# EAGLE design sample (EAGLE 9.5.0)

## Sheet 1 of 3
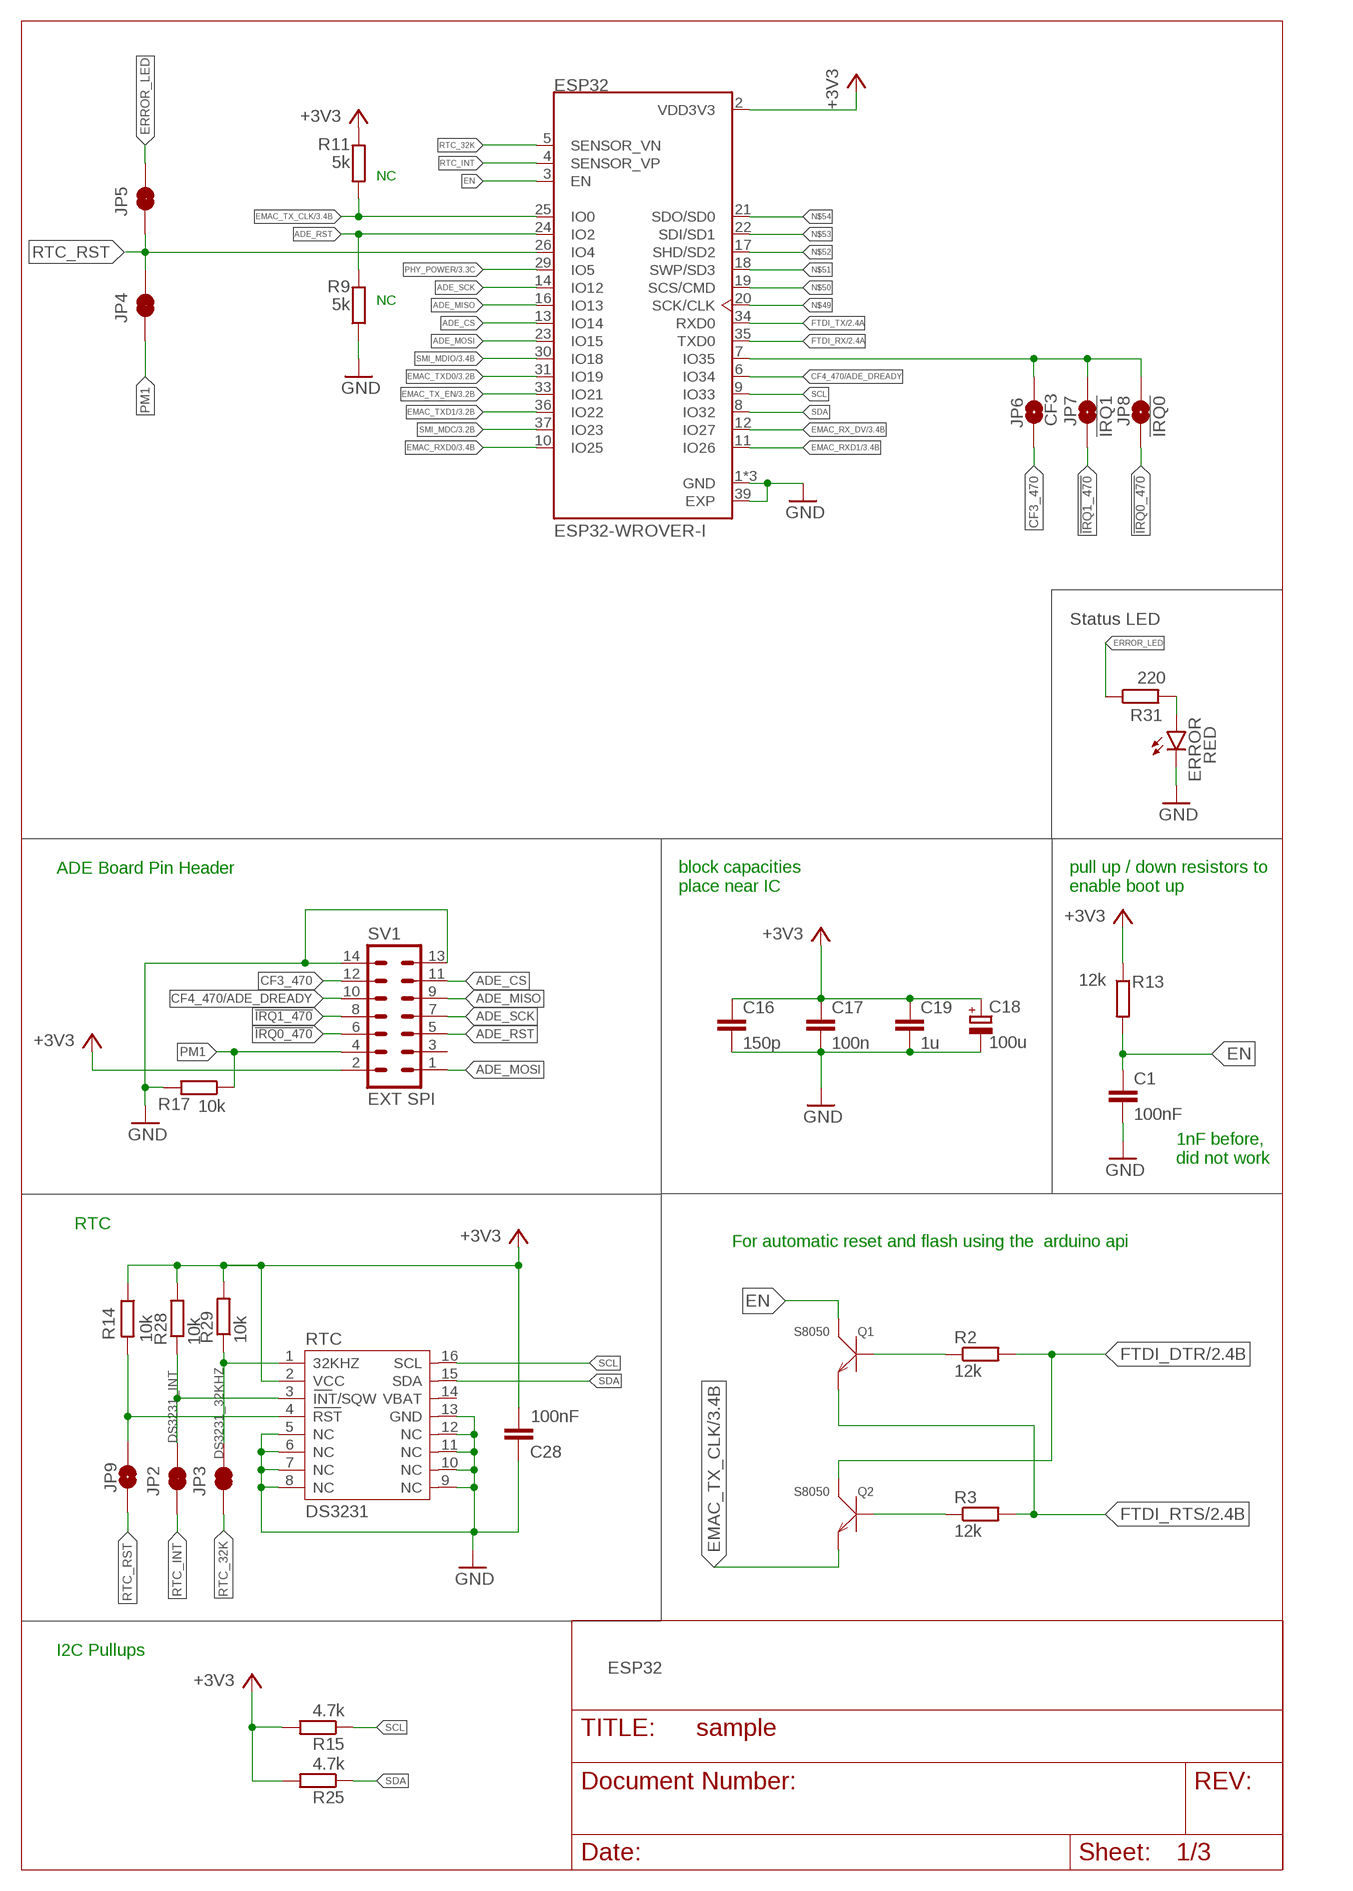
[diagram p0: schematic, sheet 1]

### Parts
C1  100nF  C-EUC0603K  [C0603K]
C16  150p  C-EUC0603K  [C0603K]
C17  100n  C-EUC0603K  [C0603K]
C18  100u  CPOL-EUD/7343-31W  [D/7343-31W]
C19  1u  C-EUC0603K  [C0603K]
C28  100nF  C-EUC0603K  [C0603K]
ERROR  RED  LEDCHIP-LED0805  [CHIP-LED0805]
ESP32  ESP32-WROVER-I  [XCVR_ESP32-WROVER-I]
JP2  INT  JUMPER-SMT_2_NC_TRACE_NO-SILK  [SMT-JUMPER_2_NC_TRACE_NO-SILK]
JP3  32K  JUMPER-SMT_2_NC_TRACE_NO-SILK  [SMT-JUMPER_2_NC_TRACE_NO-SILK]
JP4  PM1  JUMPER-SMT_2_NC_TRACE_NO-SILK  [SMT-JUMPER_2_NC_TRACE_NO-SILK]
JP5  ERROR  JUMPER-SMT_2_NC_TRACE_NO-SILK  [SMT-JUMPER_2_NC_TRACE_NO-SILK]
JP6  CF3  JUMPER-SMT_2_NO_NO-SILK  [SMT-JUMPER_2_NO_NO-SILK]
JP7  !IRQ1  JUMPER-SMT_2_NO_NO-SILK  [SMT-JUMPER_2_NO_NO-SILK]
JP8  !IRQ0  JUMPER-SMT_2_NO_NO-SILK  [SMT-JUMPER_2_NO_NO-SILK]
JP9  RST  JUMPER-SMT_2_NO_NO-SILK  [SMT-JUMPER_2_NO_NO-SILK]
Q1  S8050  SMD-TRANSISTORS-NPN-25V-500MW-S8050(SOT-23)  [SOT-23]
Q2  S8050  SMD-TRANSISTORS-NPN-25V-500MW-S8050(SOT-23)  [SOT-23]
R2  12k  R-EU_R0603  [R0603]
R3  12k  R-EU_R0603  [R0603]
R9  5k  R-EU_R0603  [R0603]
R11  5k  R-EU_R0603  [R0603]
R13  12k  R-EU_R0603  [R0603]
R14  10k  R-EU_R0603  [R0603]
R15  4.7k  R-EU_R0603  [R0603]
R17  10k  R-EU_R0402  [R0402]
R25  4.7k  R-EU_R0603  [R0603]
R28  10k  R-EU_R0603  [R0603]
R29  10k  R-EU_R0603  [R0603]
R31  220  R-EU_R0603  [R0603]
RTC  DS3231  [DS3231]
SV1  EXT SPI  ML14  [ML14]

### Nets
!IRQ0_470: JP8.2 SV1.6
!IRQ1_470: JP7.2 SV1.8
+3V3: C16.1 C17.1 C18.+ C19.1 C28.2 ESP32.2(VDD3V3) R11.1 R13.1 R14.1 R15.2 R25.2 R28.2 R29.2 RTC.2(VCC) SV1.2 ; also sheet 2,3
ADE_CS: ESP32.13(IO14) SV1.11
ADE_MISO: ESP32.16(IO13) SV1.9
ADE_MOSI: ESP32.23(IO15) SV1.1
ADE_RST: ESP32.24(IO2) R9.2 SV1.5
ADE_SCK: ESP32.14(IO12) SV1.7
CF3_470: JP6.1 SV1.12
CF4_470/ADE_DREADY: ESP32.6(IO34) SV1.10
DS3231_32KHZ: JP3.2 R29.1 RTC.1(32KHZ)
DS3231_INT: JP2.2 R28.1 RTC.3(INT/SQW)
DS3231_RST: JP9.2 R14.2 RTC.4(RST)
EMAC_RX_DV: ESP32.12(IO27) ; also sheet 3
EMAC_RXD0: ESP32.10(IO25) ; also sheet 3
EMAC_RXD1: ESP32.11(IO26) ; also sheet 3
EMAC_TX_CLK: ESP32.25(IO0) Q2.2(E) R11.2 ; also sheet 3
EMAC_TX_EN: ESP32.33(IO21) ; also sheet 3
EMAC_TXD0: ESP32.31(IO19) ; also sheet 3
EMAC_TXD1: ESP32.36(IO22) ; also sheet 3
EN: C1.1 ESP32.3(EN) Q1.3(C) R13.2
ERROR_LED: JP5.2 R31.1
FTDI_DTR: Q2.3(C) R2.2 ; also sheet 2
FTDI_RTS: Q1.2(E) R3.2 ; also sheet 2
FTDI_RX: ESP32.35(TXD0) ; also sheet 2
FTDI_TX: ESP32.34(RXD0) ; also sheet 2
GND: C1.2 C16.2 C17.2 C18.- C19.2 C28.1 ERROR.C ESP32.1(GND) ESP32.15(GND) ESP32.38(GND) ESP32.39(EXP) R9.1 R17.2 RTC.5(NC) RTC.6(NC) RTC.7(NC) RTC.8(NC) RTC.9(NC) RTC.10(NC) RTC.11(NC) RTC.12(NC) RTC.13(GND) SV1.13 SV1.14 ; also sheet 2,3
N$1: Q1.1(B) R2.1
N$2: Q2.1(B) R3.1
N$16: ERROR.A R31.2
N$29: ESP32.7(IO35) JP6.2 JP7.1 JP8.1
N$49: ESP32.20(SCK/CLK)
N$50: ESP32.19(SCS/CMD)
N$51: ESP32.18(SWP/SD3)
N$52: ESP32.17(SHD/SD2)
N$53: ESP32.22(SDI/SD1)
N$54: ESP32.21(SDO/SD0)
PHY_POWER: ESP32.29(IO5) ; also sheet 3
PM1: JP4.1 R17.1 SV1.4
RTC_32K: ESP32.5(SENSOR_VN) JP3.1
RTC_INT: ESP32.4(SENSOR_VP) JP2.1
RTC_RST: ESP32.26(IO4) JP4.2 JP5.1 JP9.1
SCL: ESP32.9(IO33) R15.1 RTC.16(SCL)
SDA: ESP32.8(IO32) R25.1 RTC.15(SDA)
SMI_MDC: ESP32.37(IO23) ; also sheet 3
SMI_MDIO: ESP32.30(IO18) ; also sheet 3
Unconnected: RTC.14(VBAT) SV1.3

### Notes on the sheet
- NC
- NC
- Status LED
- ADE Board Pin Header
- block capacities
  place near IC
- pull up / down resistors to
  enable boot up
- 1nF before,
  did not work
- RTC
- For automatic reset and flash using the  arduino api
- I2C Pullups
- ESP32

## Sheet 2 of 3
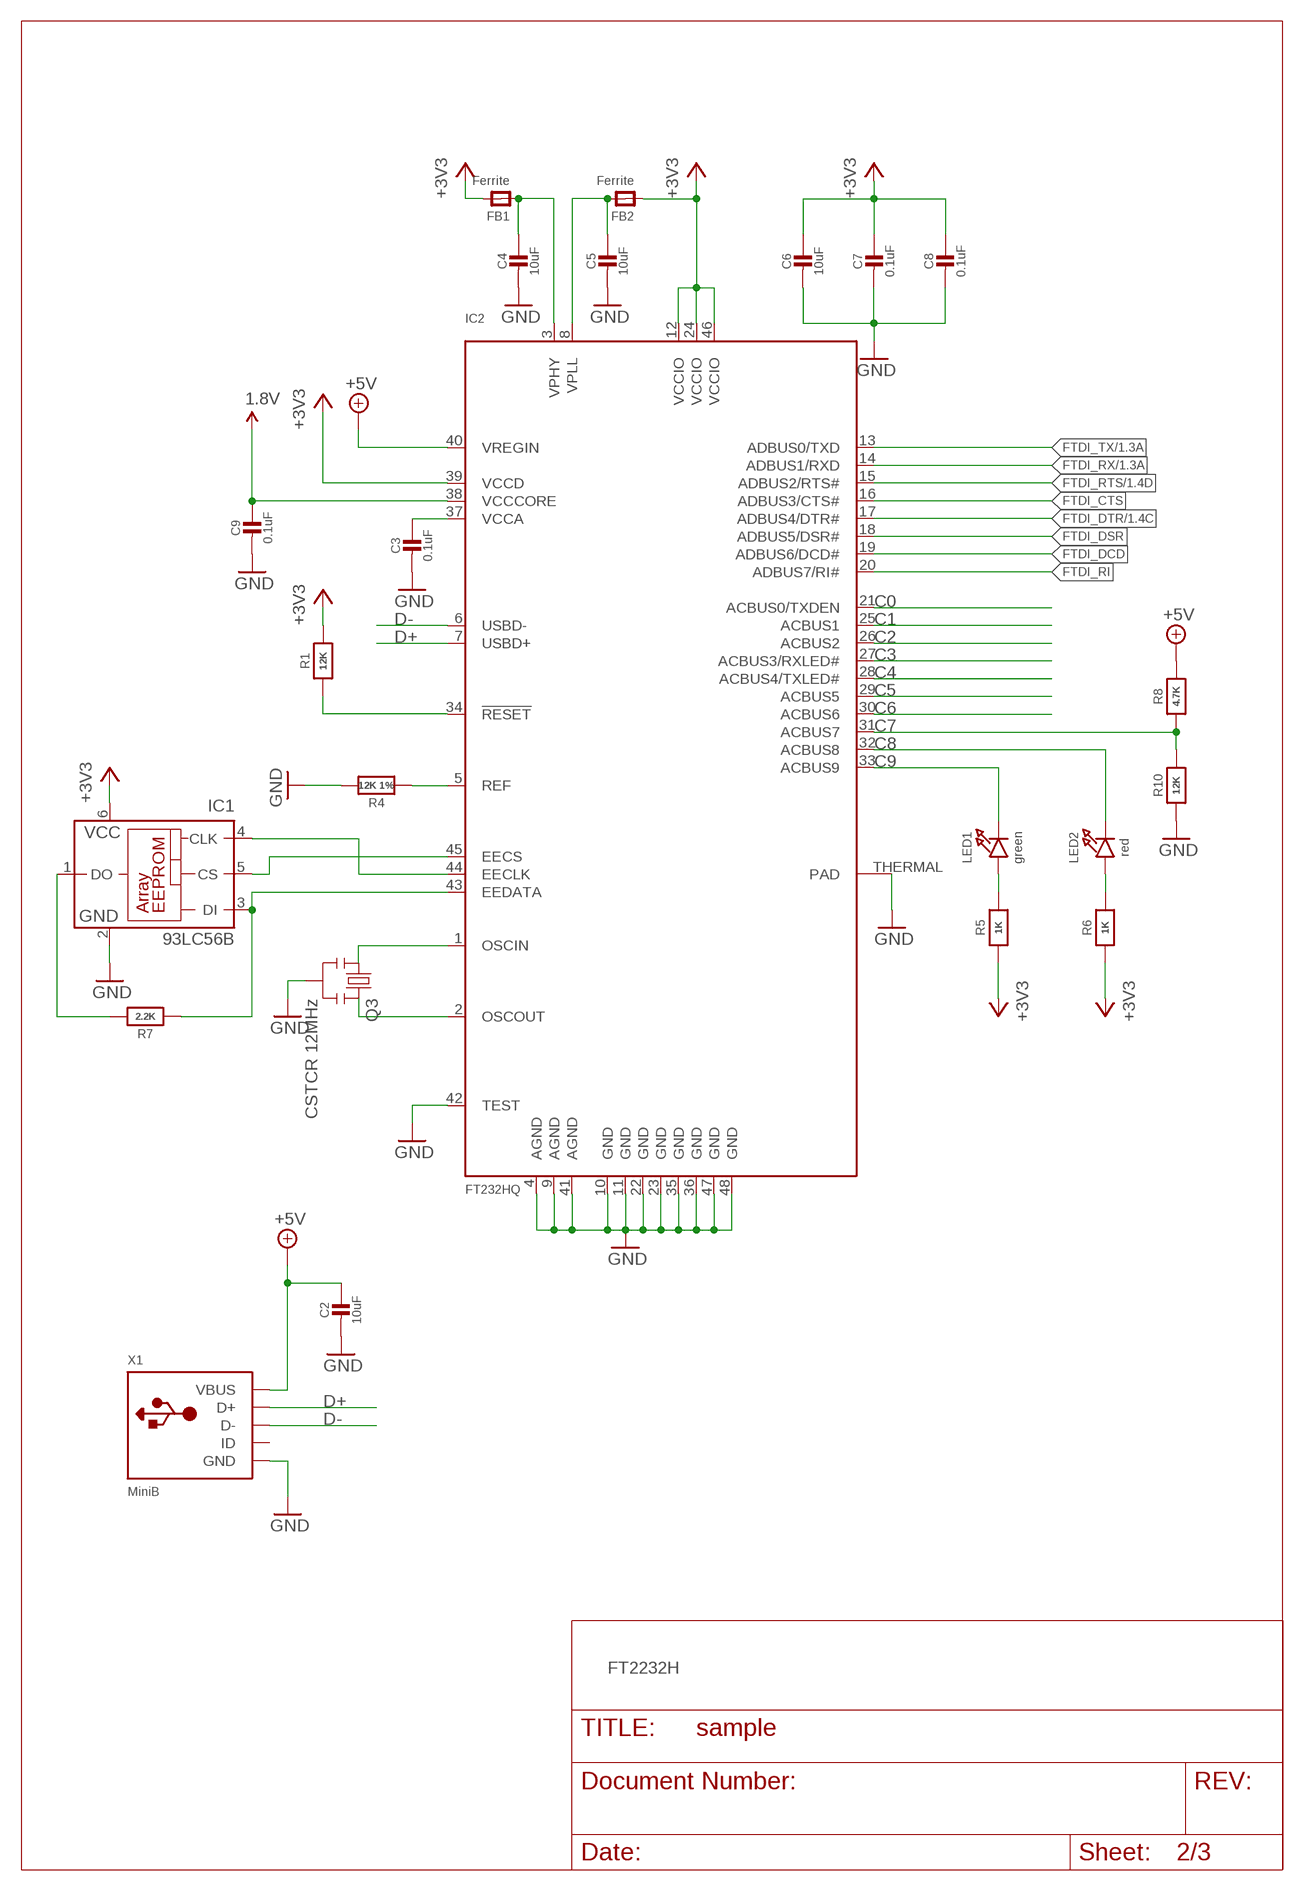
[diagram p1: schematic, sheet 2]

### Parts
C2  10uF  CAP_CERAMIC_0603MP  [_0603MP]
C3  0.1uF  CAP_CERAMIC_0603MP  [_0603MP]
C4  10uF  CAP_CERAMIC_0603MP  [_0603MP]
C5  10uF  CAP_CERAMIC_0603MP  [_0603MP]
C6  10uF  CAP_CERAMIC_0603MP  [_0603MP]
C7  0.1uF  CAP_CERAMIC_0603MP  [_0603MP]
C8  0.1uF  CAP_CERAMIC_0603MP  [_0603MP]
C9  0.1uF  CAP_CERAMIC_0603MP  [_0603MP]
FB1  Ferrite  FERRITE_0603MP  [_0603MP]
FB2  Ferrite  FERRITE_0603MP  [_0603MP]
IC1  93LC56B  93LC76A  [SOT23-6]
IC2  FT232HQ  [QFN48_8MM]
LED1  green  LED0603_NOOUTLINE  [CHIPLED_0603_NOOUTLINE]
LED2  red  LED0603_NOOUTLINE  [CHIPLED_0603_NOOUTLINE]
Q3  CSTCR 12MHz  RESONATORSMD  [RESONATOR-SMD]
R1  12K  RESISTOR_0603MP  [_0603MP]
R4  12K 1%  RESISTOR_0603MP  [_0603MP]
R5  1K  RESISTOR_0603MP  [_0603MP]
R6  1K  RESISTOR_0603MP  [_0603MP]
R7  2.2K  RESISTOR_0603MP  [_0603MP]
R8  4.7K  RESISTOR_0603MP  [_0603MP]
R10  12K  RESISTOR_0603MP  [_0603MP]
X1  MiniB  USBMICRO_20329  [4UCONN_20329]

### Nets
1.8V: C9.1 IC2.38(VCCCORE)
+3V3: C6.1 C7.1 C8.1 FB1.2 FB2.1 IC1.6(VCC) IC2.12(VCCIO) IC2.24(VCCIO) IC2.39(VCCD) IC2.46(VCCIO) R1.2 R5.1 R6.1 ; also sheet 1,3
+5V: C2.1 IC2.40(VREGIN) R8.2 X1.VBUS
C0: IC2.21(ACBUS0/TXDEN)
C1: IC2.25(ACBUS1)
C2: IC2.26(ACBUS2)
C3: IC2.27(ACBUS3/RXLED#)
C4: IC2.28(ACBUS4/TXLED#)
C5: IC2.29(ACBUS5)
C6: IC2.30(ACBUS6)
C7: IC2.31(ACBUS7) R8.1 R10.2
C8: IC2.32(ACBUS8) LED2.C
C9: IC2.33(ACBUS9) LED1.C
D+: IC2.7(USBD+) X1.D+
D-: IC2.6(USBD-) X1.D-
FTDI_CTS: IC2.16(ADBUS3/CTS#)
FTDI_DCD: IC2.19(ADBUS6/DCD#)
FTDI_DSR: IC2.18(ADBUS5/DSR#)
FTDI_DTR: IC2.17(ADBUS4/DTR#) ; also sheet 1
FTDI_RI: IC2.20(ADBUS7/RI#)
FTDI_RTS: IC2.15(ADBUS2/RTS#) ; also sheet 1
FTDI_RX: IC2.14(ADBUS1/RXD) ; also sheet 1
FTDI_TX: IC2.13(ADBUS0/TXD) ; also sheet 1
GND: C2.2 C3.2 C4.2 C5.2 C6.2 C7.2 C8.2 C9.2 IC1.2(GND) IC2.4(AGND) IC2.9(AGND) IC2.10(GND) IC2.11(GND) IC2.22(GND) IC2.23(GND) IC2.35(GND) IC2.36(GND) IC2.41(AGND) IC2.42(TEST) IC2.47(GND) IC2.48(GND) IC2.THERMAL(PAD) Q3.2 R4.2 R10.1 X1.BASE@1(GND) X1.BASE@2(GND) X1.GND X1.SPRT@1(GND) X1.SPRT@2(GND) X1.SPRT@3(GND) X1.SPRT@4(GND) ; also sheet 1,3
N$3: IC2.1(OSCIN) Q3.1
N$4: IC2.2(OSCOUT) Q3.3
N$5: IC2.5(REF) R4.1
N$6: LED2.A R6.2
N$7: IC2.34(!RESET) R1.1
N$8: LED1.A R5.2
N$9: IC1.3(DI) IC2.43(EEDATA) R7.1
N$10: IC1.5(CS) IC2.45(EECS)
N$11: IC1.4(CLK) IC2.44(EECLK)
N$12: IC1.1(DO) R7.2
VCCA: C3.1 IC2.37(VCCA)
VPHY: C4.1 FB1.1 IC2.3(VPHY)
VPLL: C5.1 FB2.2 IC2.8(VPLL)
Unconnected: X1.ID

### Notes on the sheet
- FT2232H

## Sheet 3 of 3
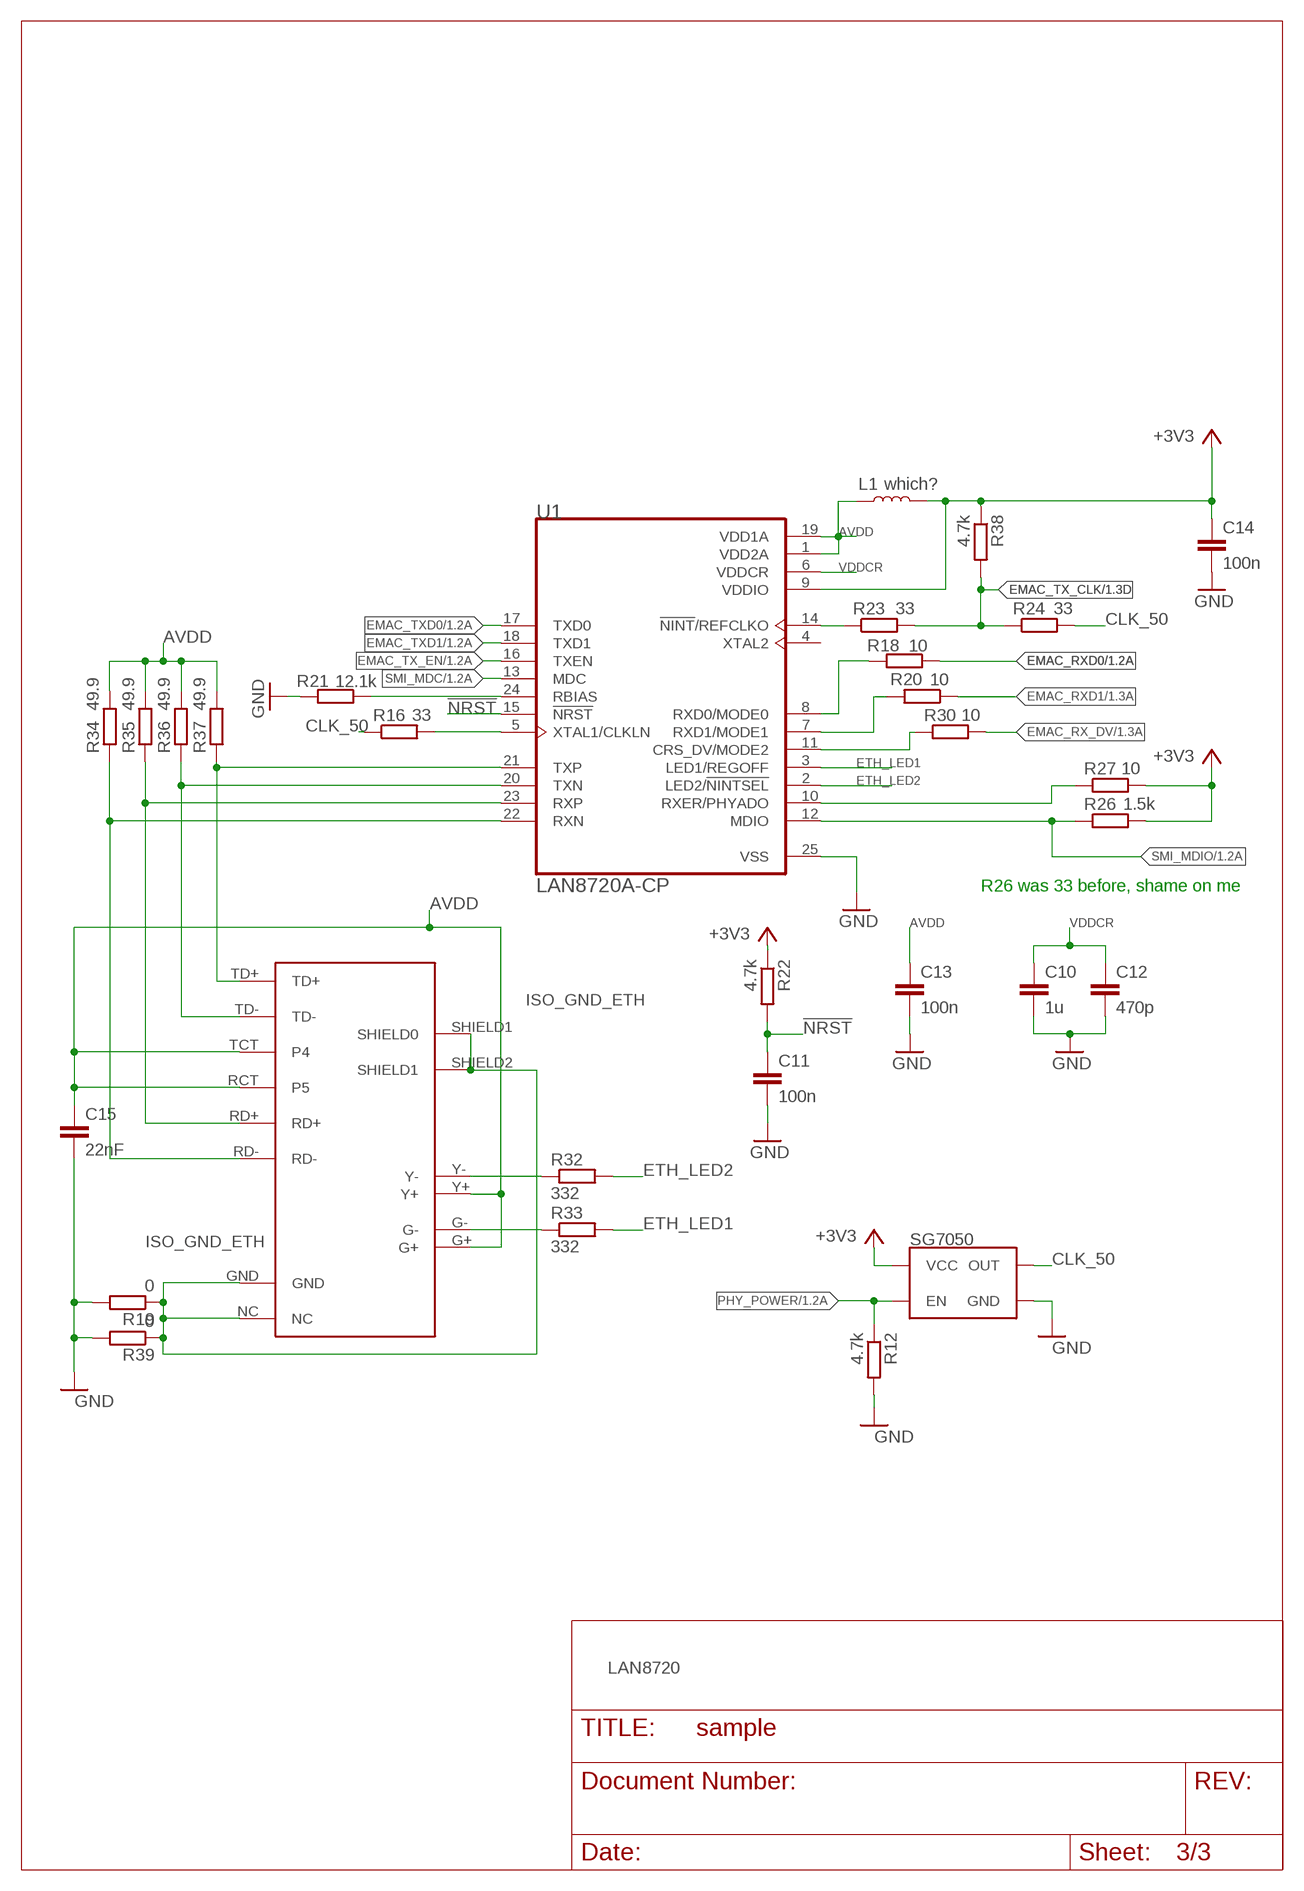
[diagram p2: schematic, sheet 3]

### Parts
C10  1u  C-EUC0402  [C0402]
C11  100n  C-EUC0603K  [C0603K]
C12  470p  C-EUC0402  [C0402]
C13  100n  C-EUC0603K  [C0603K]
C14  100n  C-EUC0603K  [C0603K]
C15  22nF  C-EUC0603K  [C0603K]
L1  which?  INDUCTOR-0603-33NH  [0603]
R12  4.7k  R-EU_R0603  [R0603]
R16  33  R-EU_R0603  [R0603]
R18  10  R-EU_R0603  [R0603]
R19  0  R-EU_R0603  [R0603]
R20  10  R-EU_R0603  [R0603]
R21  12.1k  R-EU_R0603  [R0603]
R22  4.7k  R-EU_R0603  [R0603]
R23  33  R-EU_R0603  [R0603]
R24  33  R-EU_R0603  [R0603]
R26  1.5k  R-EU_R0603  [R0603]
R27  10  R-EU_R0603  [R0603]
R30  10  R-EU_R0603  [R0603]
R32  332  R-EU_R0603  [R0603]
R33  332  R-EU_R0603  [R0603]
R34  49.9  R-EU_R0603  [R0603]
R35  49.9  R-EU_R0603  [R0603]
R36  49.9  R-EU_R0603  [R0603]
R37  49.9  R-EU_R0603  [R0603]
R38  4.7k  R-EU_R0603  [R0603]
R39  0  R-EU_R0603  [R0603]
SG7050  OSCILLATORSMD-7X5-4PAD  [OSCILLATOR-SMD-7X5-4PAD]
U1  LAN8720A-CP  [QFN50P400X400X100-25N]
U$2  HR911105A  [RJ45]

### Nets
!NRST: C11.1 R22.2 U1.15(!NRST)
+3V3: C14.1 L1.2 R22.1 R26.2 R27.2 R38.1 SG7050.4(VCC) U1.9(VDDIO) ; also sheet 1,2
AVDD: C13.1 C15.1 L1.1 R34.2 R35.2 R36.2 R37.2 U1.1(VDD2A) U1.19(VDD1A) U$2.G+ U$2.RCT(P5) U$2.TCT(P4) U$2.Y+
CLK_50: R16.1 R24.2 SG7050.3(OUT)
EMAC_RX_DV: R30.2 ; also sheet 1
EMAC_RXD0: R18.1 ; also sheet 1
EMAC_RXD1: R20.1 ; also sheet 1
EMAC_TX_CLK: R23.2 R24.1 R38.2 ; also sheet 1
EMAC_TX_EN: U1.16(TXEN) ; also sheet 1
EMAC_TXD0: U1.17(TXD0) ; also sheet 1
EMAC_TXD1: U1.18(TXD1) ; also sheet 1
ETH_LED1: R33.2 U1.3(LED1/REGOFF)
ETH_LED2: R32.2 U1.2(LED2/!NINTSEL!)
GND: C10.2 C11.2 C12.2 C13.2 C14.2 C15.2 R12.2 R19.2 R21.2 R39.2 SG7050.2(GND) U1.25(VSS) ; also sheet 1,2
ISO_GND_ETH: R19.1 R39.1 U$2.GND U$2.NC U$2.SHIELD1(SHIELD0) U$2.SHIELD2(SHIELD1)
N$14: R20.2 U1.7(RXD1/MODE1)
N$15: R18.2 U1.8(RXD0/MODE0)
N$17: R21.1 U1.24(RBIAS)
N$18: R32.1 U$2.Y-
N$19: R16.2 U1.5(XTAL1/CLKLN)
N$20: R27.1 U1.10(RXER/PHYADO)
N$21: R23.1 U1.14(!NINT!/REFCLKO)
N$22: R30.1 U1.11(CRS_DV/MODE2)
N$23: R33.1 U$2.G-
PHY_POWER: R12.1 SG7050.1(EN) ; also sheet 1
RD_N [DiffPairs]: R34.1 U1.22(RXN) U$2.RD-
RD_P [DiffPairs]: R35.1 U1.23(RXP) U$2.RD+
SMI_MDC: U1.13(MDC) ; also sheet 1
SMI_MDIO: R26.1 U1.12(MDIO) ; also sheet 1
TD_N [DiffPairs]: R36.1 U1.20(TXN) U$2.TD-
TD_P [DiffPairs]: R37.1 U1.21(TXP) U$2.TD+
VDDCR: C10.1 C12.1 U1.6(VDDCR)
Unconnected: U1.4(XTAL2)

### Notes on the sheet
- R26 was 33 before, shame on me
- LAN8720

## Library data of the parts
C1 C10-C17 C19 C28 = rcl:C-EU: CAPACITOR, European symbol; SPICEPREFIX: C
C2-C9 = microbuilder:CAP_CERAMIC: Ceramic Capacitors For new designs, use the packages preceded by an '_' character since they are more reliable: The following footprints should be used on most boards: _0402 - Standard footprint for regular board layouts _0603 - Standard footprint for regular board layouts _0805 - Standard footprint for regular board layouts _1206 - Standard footprint for regular board layouts For extremely tight-pitch boards where space is at a premium, the following 'micro-pitch' footprints can be used (smaller pads, no silkscreen outline, etc.): _0402MP - Micro-pitch footprint for very dense/compact boards _0603MP - Micro-pitch footprint for very dense/compact boards _0805MP - Micro-pitch footprint for very dense/compact boards _1206MP - Micro-pitch footprint for very dense/compact boards
C18 = rcl:CPOL-EU: POLARIZED CAPACITOR, European symbol; SPICEPREFIX: C
ERROR = led:LED: LED
ESP32 = ESP32-WROVER-I:ESP32-WROVER-I: Module: combo; GPIO, I2C x2, I2S x2, SDIO, SPI x3, UART x3; U.FL; AVAILABILITY: Unavailable; DESCRIPTION: Module: combo; GPIO, I2C x2, I2S x2, SDIO, SPI x3, UART x3; U.FL; MF: Espressif Systems; MP: ESP32-WROVER-I; PACKAGE: Module Espressif Systems; PRICE: None
FB1 FB2 = microbuilder:FERRITE: Ferrite Bead 0603 MMZ1608B121C - 120 Ohm @ 100MHz, 600mA, 0.15 Ohm DC Resistance - Digikey: 445-2164-1-ND BK1608HW121-T - 120 Ohm, 600mA Ferrite Chip - Digikey: 587-1876-2-ND 0805 HZ0805B272R-10 - 2.7K Ohm @ 100MHz, 200mA, 0.8 Ohm DC Resistance - Digikey: 240-2504-1-ND (see also Murata BLM21BD272SN1L) MMZ2012Y152B - 1.5K Ohm @ 100MHz, 500mA, 0.4 Ohm DC Resistance - Digikey: 445-1560-1-ND - Mainly for high frequency (80-400MHz) MMZ2012R102A - 1K Ohm @ 100MHz, 500mA, 0.3 Ohm DC Resistance - Digikey: 445-1555-2-ND - More general purpose (10-200MHz)
IC1 = microchip:93*76?: 8K Microwire Compatible Serial EEPROM Source: http://ww1.microchip.com/downloads/en/DeviceDoc/21796H.pdf; MF: MICROCHIP; MPN: 93LC76AT-I/OT; OC_FARNELL: 1556170; OC_NEWARK: 61H6824
IC2 = microbuilder:FT232H
JP2-JP5 = SparkFun-Jumpers:JUMPER-SMT_2_NC_TRACE: Normally closed trace jumper This jumper has a trace between two pads so it's normally closed (NC). Use a razor knife to open the connection. For best results follow the IPC guidelines for cutting traces: Cutout at least 0.063 mm (0.005 in). Remove all loose material to clean up the cut area. Seal the cut with an approved epoxy. Reapply solder to reclose the connection.
JP6-JP9 = SparkFun-Jumpers:JUMPER-SMT_2_NO: Normally open jumper This jumper has two pads in close proximity to each other. Apply solder to close the connection. Round pads are easier to solder for beginners, but are a lot larger. SparkFun Product that uses the round pads: SparkFun EL Sequencer <https://www.sparkfun.com/products/12781>
L1 = SparkFun-Coils:INDUCTOR: Inductors Resist changes in electrical current. Basically a coil of wire. SparkFun Products: SparkFun Load Cell Amplifier - HX711 <https://www.sparkfun.com/products/13879> IOIO-OTG - V2.2 <https://www.sparkfun.com/products/13613>; PROD_ID: NDUC-07874; VALUE: 33nH/±5%/500mA
LED1 LED2 = microbuilder:LED: LED
Q1 Q2 = Seeed-Transistor:SMD-TRANSISTORS-NPN-25V-500MW-S8050(SOT-23): 305010017; MPN: S8050
Q3 = SparkFun:RESONATOR: Resonator Small SMD resonator. This is the itty bitty 10/20MHz resonators with built in caps. CSTCE10M0G55 and CSTCE20M0V53. Footprint has been reviewed closely but hasn't been tested yet.
R1 R4-R8 R10 = microbuilder:RESISTOR: Resistors For new designs, use the packages preceded by an '_' character since they are more reliable: The following footprints should be used on most boards: _0402 - Standard footprint for regular board layouts _0603 - Standard footprint for regular board layouts _0805 - Standard footprint for regular board layouts _1206 - Standard footprint for regular board layouts For extremely tight-pitch boards where space is at a premium, the following 'micro-pitch' footprints can be used (smaller pads, no silkscreen outline, etc.): _0402MP - Micro-pitch footprint for very dense/compact boards _0603MP - Micro-pitch footprint for very dense/compact boards _0805MP - Micro-pitch footprint for very dense/compact boards _1206MP - Micro-pitch footprint for very dense/compact boards
R2 R3 R9 R11-R39 = resistor:R-EU_: RESISTOR, European symbol
RTC = _lh-library:DS3231
SG7050 = SparkFun-Clocks:OSCILLATOR: Oscillators (Generic) These are active oscillators, which require a power source to generate their clock output. Most oscillators are configured to generate a set frequency (e.g. 16MHz). They have four pins: power, ground, output, and an enable input.
SV1 = con-harting-ml:ML14: HARTING; OC_FARNELL: unknown; OC_NEWARK: unknown
U1 = LAN8720A-CP:LAN8720A-CP: LAN8720A Series 3.3 V RMII 10/100 Ethernet Transceiver Surface Mount - QFN-24; AVAILABILITY: Unavailable; DESCRIPTION: LAN8720A Series 3.3 V RMII 10/100 Ethernet Transceiver Surface Mount - QFN-24; MF: Microchip; MP: LAN8720A-CP; PACKAGE: QFN-24 Microchip; PRICE: None
U$2 = HR911105A:HR911105A
X1 = microbuilder:USB: USB Connectors USBMINIB - Surface Mount Female Mini-B USB Connector 4UConnector: 06564

## Net classes
1 DiffPairs: width 0.051 mm

## Board
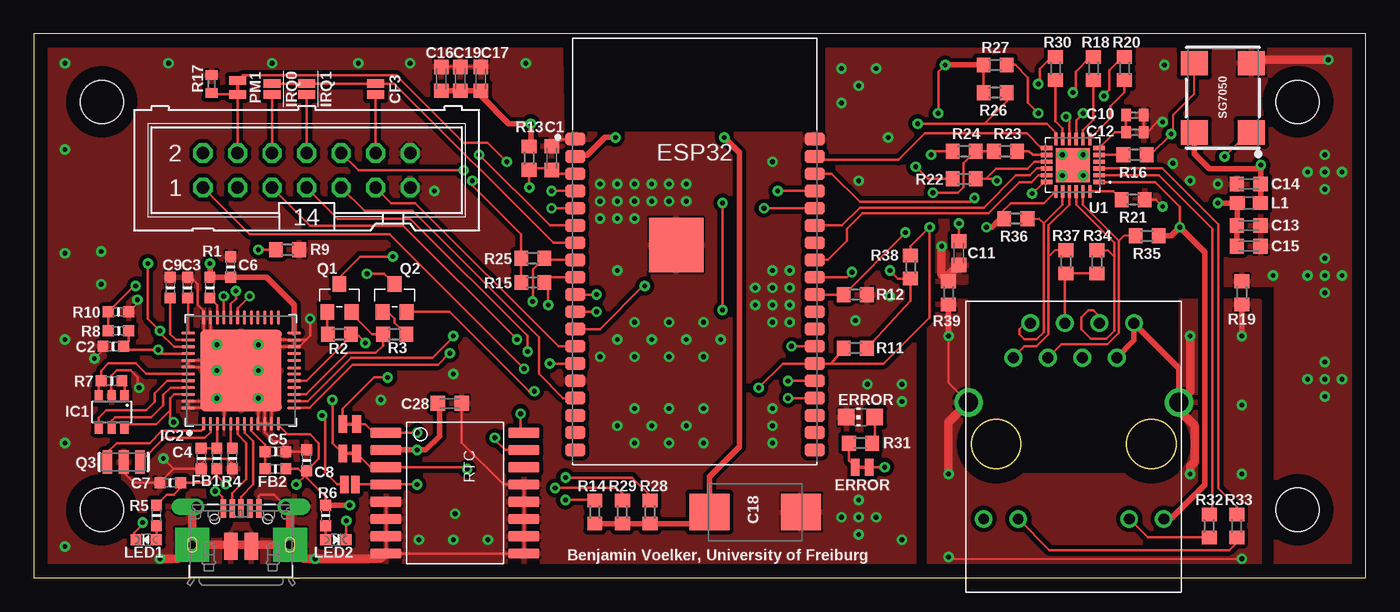
[diagram p3: board, top side]
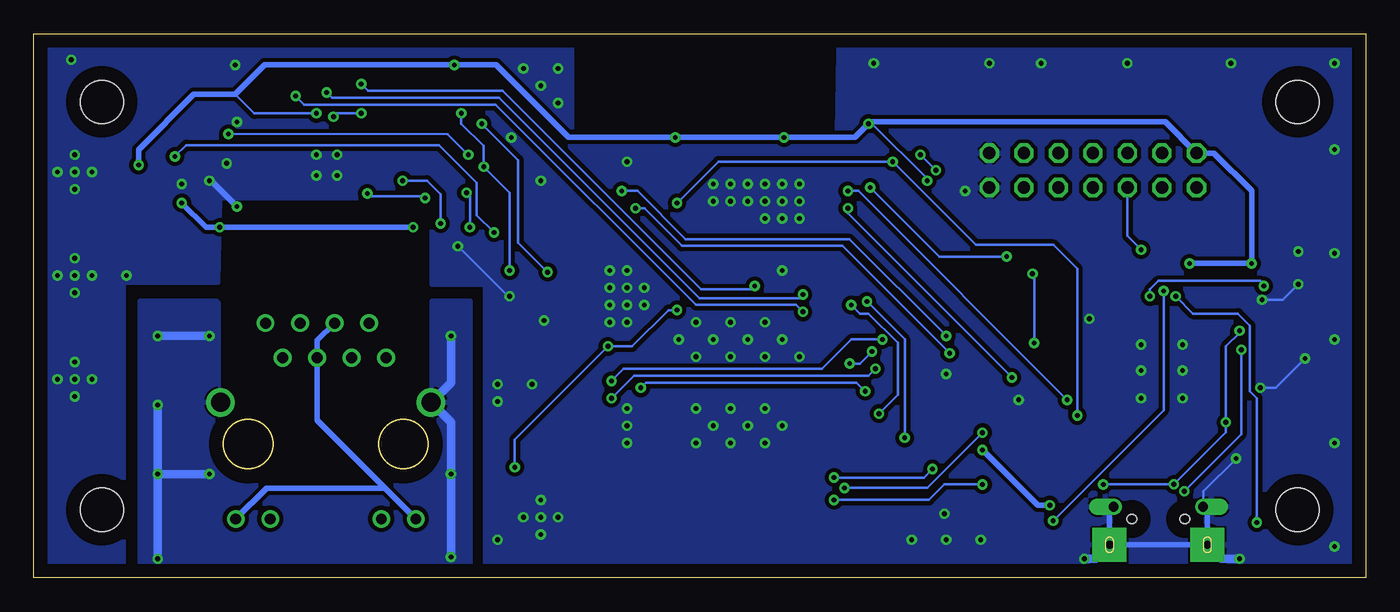
[diagram p4: board, bottom side, seen from below]

Size 98 x 40 mm. Coordinates in mm from the lower left corner, seen from the top.
Outline: 0,0 98,0 98,40 0,40 0,0
Copper layers (1*16): Top 0.035mm / dielectric 1.5mm / Bottom 0.035mm
Design rules "default *": minimum track width 6mil, minimum drill 0.35mm, track to track 6mil, track to pad 6mil, pad to pad 6mil, via to via 6mil, smd to smd 6mil, copper to edge 40mil, drill to drill 4mil, minimum pad ring 10mil, minimum via ring 8mil, stop-mask expansion 4mil, vias tented up to drill 0mil, thermal gap 6mil
Holes 3.2 mm at 5,35 5,5 93,5 93,35

### Footprints (pad centres in the part's own frame; a part is rotated, then mirrored left to right if it is on the bottom)
C0603K = smd 1.05 x 1.08: 1 -0.875,0; 2 0.875,0
_0603MP = smd 0.8 x 0.8: 1 -0.762,0; 2 0.762,0
C0402 = smd 0.7 x 0.9: 1 -0.65,0; 2 0.65,0
D/7343-31W = smd 2.95 x 2.7: + 3.375,0; - -3.375,0
CHIP-LED0805 = smd 1.2 x 1.2: A 0,-1.05; C 0,1.05
XCVR_ESP32-WROVER-I = smd 1.45 x 0.93: 1 -8.81,8.26; 2 -8.81,6.99; 3 -8.81,5.72; 4 -8.81,4.45; 5 -8.81,3.18; 6 -8.81,1.91; 7 -8.81,0.64; 8 -8.81,-0.63; 9 -8.81,-1.9; 10 -8.81,-3.17; 11 -8.81,-4.44; 12 -8.81,-5.71; 13 -8.81,-6.98; 14 -8.81,-8.25; 15 -8.81,-9.52; 16 -8.81,-10.79; 17 -8.81,-12.06; 18 -8.81,-13.33; 19 -8.81,-14.6; 20 8.81,-14.6; 21 8.81,-13.33; 22 8.81,-12.06; 23 8.81,-10.79; 24 8.81,-9.52; 25 8.81,-8.25; 26 8.81,-6.98; 27 8.81,-5.71; 28 8.81,-4.44; 29 8.81,-3.17; 30 8.81,-1.9; 31 8.81,-0.63; 32 8.81,0.64; 33 8.81,1.91; 34 8.81,3.18; 35 8.81,4.45; 36 8.81,5.72; 37 8.81,6.99; 38 8.81,8.26 | smd 4 x 4: 39 -1.38,0.47
SOT23-6 = smd 0.6 x 0.9: 1 -0.95,-1.15; 2 0,-1.15; 3 0.95,-1.15; 4 0.95,1.15; 5 0,1.15; 6 -0.95,1.15
QFN48_8MM = smd 1 x 0.23: 1 -3.9,2.75; 2 -3.9,2.25; 3 -3.9,1.75; 4 -3.9,1.25; 5 -3.9,0.75; 6 -3.9,0.25; 7 -3.9,-0.25; 8 -3.9,-0.75; 9 -3.9,-1.25; 10 -3.9,-1.75; 11 -3.9,-2.25; 12 -3.9,-2.75; 25 3.9,-2.75; 26 3.9,-2.25; 27 3.9,-1.75; 28 3.9,-1.25; 29 3.9,-0.75; 30 3.9,-0.25; 31 3.9,0.25; 32 3.9,0.75; 33 3.9,1.25; 34 3.9,1.75; 35 3.9,2.25; 36 3.9,2.75 | smd 0.23 x 1: 13 -2.75,-3.9; 14 -2.25,-3.9; 15 -1.75,-3.9; 16 -1.25,-3.9; 17 -0.75,-3.9; 18 -0.25,-3.9; 19 0.2,-3.9; 20 0.75,-3.9; 21 1.25,-3.9; 22 1.75,-3.9; 23 2.25,-3.9; 24 2.75,-3.9; 37 2.75,3.9; 38 2.25,3.9; 39 1.75,3.9; 40 1.25,3.9; 41 0.75,3.9; 42 0.25,3.9; 43 -0.25,3.9; 44 -0.75,3.9; 45 -1.25,3.9; 46 -1.75,3.9; 47 -2.25,3.9; 48 -2.75,3.9 | smd 6 x 6: THERMAL 0,0
SMT-JUMPER_2_NC_TRACE_NO-SILK = smd 0.635 x 1.27: 1 -0.508,0; 2 0.508,0
SMT-JUMPER_2_NO_NO-SILK = smd 0.635 x 1.27: 1 -0.406,0; 2 0.406,0
0603 = smd 1.1 x 1: 1 -0.85,0; 2 0.85,0
CHIPLED_0603_NOOUTLINE = smd 0.8 x 0.8: A 0,-0.75; C 0,0.75
SOT-23 = smd 1.016 x 1.143: 1 -0.889,-1.016; 2 0.889,-1.016; 3 0,1.016
RESONATOR-SMD = smd 0.7 x 1.7: 1 -1.2,0; 2 0,0; 3 1.2,0
R0603 = smd 1 x 1.1: 1 -0.85,0; 2 0.85,0
R0402 = smd 0.7 x 0.9: 1 -0.65,0; 2 0.65,0
DS3231 = smd 0.762 x 2.286: 1 -4.445,-5.08; 2 -3.175,-5.08; 3 -1.905,-5.08; 4 -0.635,-5.08; 5 0.635,-5.08; 6 1.905,-5.08; 7 3.175,-5.08; 8 4.445,-5.08; 9 4.445,5.08; 10 3.175,5.08; 11 1.905,5.08; 12 0.635,5.08; 13 -0.635,5.08; 14 -1.905,5.08; 15 -3.175,5.08; 16 -4.445,5.08
OSCILLATOR-SMD-7X5-4PAD = smd 1.8 x 2: 1 -2.54,-2.095; 2 2.54,-2.095; 3 2.54,2.104; 4 -2.54,2.104
ML14 = drill 0.914 octagon: 1 -7.62,-1.27; 2 -7.62,1.27; 3 -5.08,-1.27; 4 -5.08,1.27; 5 -2.54,-1.27; 6 -2.54,1.27; 7 0,-1.27; 8 0,1.27; 9 2.54,-1.27; 10 2.54,1.27; 11 5.08,-1.27; 12 5.08,1.27; 13 7.62,-1.27; 14 7.62,1.27
QFN50P400X400X100-25N = smd 0.86 x 0.26: 1 -1.935,1.25; 2 -1.935,0.75; 3 -1.935,0.25; 4 -1.935,-0.25; 5 -1.935,-0.75; 6 -1.935,-1.25; 13 1.935,-1.25; 14 1.935,-0.75; 15 1.935,-0.25; 16 1.935,0.25; 17 1.935,0.75; 18 1.935,1.25 | smd 0.26 x 0.86: 7 -1.25,-1.935; 8 -0.75,-1.935; 9 -0.25,-1.935; 10 0.25,-1.935; 11 0.75,-1.935; 12 1.25,-1.935; 19 1.25,1.935; 20 0.75,1.935; 21 0.25,1.935; 22 -0.25,1.935; 23 -0.75,1.935; 24 -1.25,1.935 | smd 2.5 x 2.5: 25 0,0
RJ45 = drill 0.8: G+ 5.84,-6.305; G- 5.84,-3.765; GND -8.57,4.76; NC -6.03,3.5; RCT -6.03,0.96; RD+ -6.03,-1.58; RD- -8.57,2.22; TCT -8.57,-0.32; TD+ -6.03,-4.12; TD- -8.57,-2.86; Y+ 5.84,6.945; Y- 5.84,4.405 | drill 1.4: SHIELD1 -2.73,-7.425; SHIELD2 -2.73,8.065
4UCONN_20329 = smd 1 x 2: BASE@1 -0.75,-2; BASE@2 0.75,-2 | smd 0.4 x 1.35: D+ 0,0.775; D- -0.65,0.775; GND 1.3,0.775; ID 0.65,0.775; VBUS -1.3,0.775 | drill 0.7 offset: SPRT@1 -3.3,0.9; SPRT@2 3.3,0.9 | drill 0.6 pad 2.5 square: SPRT@3 -3.6,-1.9; SPRT@4 3.6,-1.9 | hole 0.7: -1.95,0; 1.95,0

### Placement (x,y rotation side)
C1  38.1,30.86 90 top
C2  5.84,17.02 180 top
C3  11.3,21.34 90 top
C4  12.32,8.76 270 top
C5  17.78,9.27 0 top
C6  14.48,22.86 90 top
C7  10.03,6.99 180 top
C8  20.07,8.64 90 top
C9  10.03,21.34 90 top
C10  81.03,34.04 0 top
C11  68.07,23.88 270 top
C12  81.03,32.77 0 top
C13  89.41,25.91 0 top
C14  89.41,28.96 180 top
C15  89.41,24.38 0 top
C16  29.97,36.7 90 top
C17  32.89,36.7 90 top
C18  53.09,4.83 180 top
C19  31.37,36.7 90 top
C28  30.61,12.83 180 top
ERROR  60.83,11.81 90 top
ESP32  48.64,24 0 top
FB1  13.46,8.76 270 top
FB2  17.78,8 180 top
IC1  5.71,12.19 180 top
IC2  15.24,15.24 90 top
JP2  23.24,9.14 0 top
JP3  23.24,11.3 0 top
JP4  14.99,36.07 90 top
JP5  60.96,8.13 180 top
JP6  25.15,35.94 90 top
JP7  20.07,35.94 270 top
JP8  17.53,35.94 270 top
JP9  23.24,6.86 0 top
L1  89.41,27.56 0 top
LED1  8.26,2.79 90 top
LED2  22.23,2.79 270 top
Q1  22.48,20.57 0 top
Q2  26.54,20.57 0 top
Q3  6.6,8.51 0 top
R1  12.95,21.34 90 top
R2  22.48,17.91 0 top
R3  26.54,17.91 180 top
R4  14.61,8.76 270 top
R5  9.02,4.57 270 top
R6  21.46,4.57 270 top
R7  5.71,14.48 0 top
R8  6.22,18.16 0 top
R9  18.67,24.13 180 top
R10  6.22,19.56 180 top
R11  60.45,16.89 180 top
R12  60.45,20.83 0 top
R13  36.45,30.86 270 top
R14  41.27,4.83 90 top
R15  36.7,21.72 180 top
R16  81.03,31.11 180 top
R17  13.08,36.32 90 top
R18  77.98,37.47 270 top
R19  88.9,20.95 90 top
R20  80.26,37.47 270 top
R21  80.9,27.81 0 top
R22  68.45,29.34 0 top
R23  71.5,31.37 180 top
R24  68.45,31.37 180 top
R25  36.7,23.5 180 top
R26  70.74,35.69 180 top
R27  70.74,37.72 180 top
R28  45.34,4.83 270 top
R29  43.31,4.83 270 top
R30  75.18,37.47 90 top
R31  60.83,9.91 0 top
R32  86.49,3.81 90 top
R33  88.52,3.81 90 top
R34  78.23,23.24 270 top
R35  81.92,25.15 0 top
R36  72.26,26.42 180 top
R37  75.95,23.24 270 top
R38  64.52,22.86 90 top
R39  67.31,20.95 90 top
RTC  30.99,6.22 270 top
SG7050  87.5,35.31 90 top
SV1  20.07,29.97 0 top
U1  76.45,30.35 180 top
U$2  76.2,10.16 270 top
X1  15.24,4.32 0 top

### Tracks (layer width: path | path; a pad name or v marks a point on that pad's centre or on a via)
1.8V
  Top 0.2: IC2.38 10.45,17.49 10.03,17.91 C9.1
!IRQ0_470
  Top 0.2: JP8.2 SV1.6
!IRQ1_470
  Top 0.2: JP7.2 SV1.8
!NRST  (via drill 0.35)
  Top 0.2: U1.15 73.63,30.6 73.12,30.09 70.81,30.09 70.05,29.34 R22.2 70.74,29.34 v70.87,29.21 | C11.1 v68.07,26.05
  Bottom 0.2: v70.87,29.21 v70.86,29.21 69.08,29.21 68.07,28.2 v68.07,26.05
+3V3  (via drill 0.35)
  Top 0.2: IC2.46 10.31,13.49 10.03,13.21 10.03,12.32 | 10.03,12.32 9.01,11.3 6.92,11.3 IC1.6 | R6.1 21.46,5.97 20.07,7.37 | FB2.1 19.43,8 20.07,7.37 | 20.07,7.62 C8.1 20.95,8.76 20.95,9.91 20.32,10.54 18.67,10.54 17.99,11.22 IC2.12 | 20.07,7.62 20.07,7.37 | R5.1 9.78,6.1 10.29,6.1 10.79,6.6 C7.1 12.83,6.99 13.4,7.56 | v14.11,6.87 v14.09,6.87 13.4,7.56 | v19.3,6.86 20.07,7.62 | 13.4,7.56 13.46,7.62 FB1.2 | 10.03,12.32 10.03,11.68 v10.28,11.43 | IC2.39 10.31,16.99 9.27,18.03 v9.27,18.16 8.38,19.05 v8.38,23.11 | R26.2 R27.2 | U1.9 76.7,33.65 v77.22,34.16 | R22.1 65.79,29.34 v64.9,30.23 | v66.55,34.17 66.55,37.21 v67.06,37.72 | R15.2 R25.2 35.85,25.27 32.26,28.87 v32.26,29.21 | 29.84,12.82 C28.2 | v62.99,22.61 63.59,22.01 R38.1 64.52,20.37 R11.1
  Top 0.406: v12.95,23.11 R1.2 C6.1 17.11,22.1 19.14,20.07 IC2.24 | v67.06,37.72 R27.2 | ESP32.2 39.9,31.06 40.69,31.06 42.02,32.38 v42.8,32.38 | RTC.2 v28.19,9.4 28.83,9.4 29.84,10.41 29.84,12.82 | v23.24,5.33 R6.1 | L1.2 90.28,27.58 C14.1 90.3,28.97 v90.3,30.35 90.04,30.1 86.49,30.1 85.4,31.19 SG7050.4 | C16.1 C19.1 C17.1 32.89,35.45 34.94,33.4 v36.58,33.4 36.58,31.84 R13.1 | v50.8,32.38 51.91,31.27 51.91,9.61 49.73,7.42 49.73,4.84 C18.+ 48.86,3.98 R28.2 R29.2 R14.1
  Bottom 0.2: v19.3,6.86 v19.3,6.87 v14.11,6.87 10.28,10.69 v10.28,11.43 10.28,17.02 9.27,18.04 v9.27,18.16 | v77.22,34.16 81.79,34.16 83.19,35.56 | v66.55,34.17 66.55,33.41 64.9,31.76 v64.9,30.23 62.99,28.32 v62.99,22.61 | v32.26,29.21 32.26,29.34 36.32,33.4 v36.58,33.4
  Bottom 0.406: v12.95,23.11 v8.38,23.11 8.38,28.45 11.18,31.24 SV1.2 14.73,33.53 36.45,33.53 v36.58,33.4 37.59,32.38 v42.8,32.38 v50.8,32.38 58.67,32.38 64.01,37.72 v67.06,37.72 81.03,37.72 83.19,35.56 86.23,35.56 90.3,31.5 v90.3,30.35 | v28.19,9.4 24.13,5.33 v23.24,5.33
+5V  (via drill 0.35)
  Top 0.2: IC2.40 9.14,16.49 v9.14,16.76 6.6,16.76 C2.1 6.99,17.4 R8.2 | v13.34,6.35 13.46,6.35 13.84,5.97 13.84,5.19 X1.VBUS
  Bottom 0.2: v9.14,16.76 9.14,10.54 v13.34,6.35
ADE_CS
  Top 0.2: SV1.11 26.29,27.56 28.07,27.56 38.6,17.02 ESP32.13
ADE_MISO
  Top 0.2: SV1.9 24.32,26.99 27.86,26.99 37.16,17.69 37.16,14.99 38.94,13.21 ESP32.16
ADE_MOSI  (via drill 0.35)
  Top 0.2: SV1.1 15.88,25.27 26.16,25.27 v36.07,15.37 | v55.5,13.21 ESP32.23
  Bottom 0.2: v36.07,15.37 v36.08,15.37 36.58,14.86 53.84,14.86 v55.5,13.21
ADE_RST  (via drill 0.35)
  Top 0.2: v35.56,17.53 27.18,25.91 20.32,25.91 SV1.5 | v55.5,14.48 ESP32.24 | R9.2 v16.51,24.13
  Bottom 0.2: v35.56,17.53 37.85,17.53 40.01,15.37 54.61,15.37 v55.5,14.48 | SV1.5 17.53,25.15 v16.51,24.13
ADE_SCK  (via drill 0.35)
  Top 0.2: SV1.7 22.35,26.42 27.69,26.42 36.32,17.78 v36.32,16.64 | ESP32.14 v37.98,15.75 v37.97,15.75
  Bottom 0.2: v37.97,15.75 37.21,15.75 v36.32,16.64
AVDD  (via drill 0.35)
  Top 0.2: 71.12,26.42 R36.2 | U1.19 74.34,27.56 71.88,27.56 71.12,26.8 71.12,26.42 | 71.12,26.42 71.12,26.29 | U$2.TCT 75.88,22.32 R37.2 R34.2 | U1.1 82.53,29.1 84.33,27.3 v84.33,25.78
  Top 0.406: v70.1,25.78 70.48,25.78 70.99,26.29 71.12,26.29 | R35.2 83.69,25.15 v84.33,25.78 86.18,23.93 86.18,6.85 83.65,4.32 U$2.Y+ | C15.1 C13.1 88.56,25.93 L1.1 v87.12,27.56
  Bottom 0.406: U$2.TCT 77.16,17.45 U$2.RCT 77.16,11.59 72.16,6.58 | U$2.G+ 72.16,6.58 | 72.16,6.58 80.88,6.58 U$2.Y+ | v70.1,25.78 v84.33,25.78 85.34,25.78 v87.12,27.56
C7  (via drill 0.35)
  Top 0.2: R8.1 R10.2 7.37,21.46 v7.49,21.46 | v15.88,20.7 15.86,20.7 14.99,19.83 IC2.31
  Bottom 0.2: v15.88,20.7 15.88,21.21 15.24,21.84 7.75,21.84 7.49,21.59 v7.49,21.46
C8  (via drill 0.35)
  Top 0.2: IC2.32 14.49,20.16 14.87,20.54 14.87,20.71 14.86,20.73 v14.86,21.08 | v22.99,4.19 22.99,2.81 LED2.C
  Bottom 0.2: v14.86,21.08 14.86,12.32 v22.99,4.19
C9  (via drill 0.35)
  Top 0.2: IC2.33 13.97,19.16 v13.97,20.7 | v8,4.06 8,3.94 7.37,3.3 7.37,2.93 LED1.C
  Bottom 0.2: v8,4.06 8,13.21 8.51,13.71 8.51,18.54 9.39,19.43 12.7,19.43 v13.97,20.7
CF3_470
  Top 0.2: SV1.12 JP6.1
CF4_470/ADE_DREADY  (via drill 0.35)
  Top 0.2: v32.77,31.11 37.97,25.91 ESP32.6 | v31.62,29.97 23.88,29.97 SV1.10
  Bottom 0.2: v32.77,31.11 v31.62,29.97
CLK_50  (via drill 0.35)
  Top 0.152: SG7050.3 85.4,35.61 83.82,34.04 83.82,32.77 v83.69,32.64 82.17,31.11 R16.1
  Top 0.2: R24.2 66.29,31.37 v66.04,31.11
  Bottom 0.152: 67.56,32.64 v83.69,32.64
  Bottom 0.2: v66.04,31.11 67.56,32.64
D+
  Top 0.2: IC2.7 15.49,10.67 16.13,10.03 16.13,6.86 15.24,5.97 X1.D+
D-
  Top 0.2: X1.D- 14.59,6.21 15.62,7.24 15.62,9.91 14.99,10.54 IC2.6
DS3231_32KHZ  (via drill 0.35)
  Top 0.2: R29.1 43.31,6.18 42.89,6.6 v38.35,6.6 | v28.19,10.67 RTC.1 25.02,10.67 24.38,11.3 JP3.2
  Bottom 0.2: v38.35,6.6 32.26,6.6 v28.19,10.67
DS3231_INT  (via drill 0.35)
  Top 0.2: JP2.2 24.77,8.13 RTC.3 31.75,8.13 v31.88,8 | v39.12,7.37 44.03,7.37 45.34,6.06 R28.1
  Bottom 0.2: v31.88,8 32.51,7.37 v39.12,7.37
DS3231_RST  (via drill 0.35)
  Top 0.2: JP9.2 RTC.4 v28.19,6.86 | R14.2 41.24,5.71 v39.12,5.71
  Bottom 0.2: v28.19,6.86 30.99,6.86 32.13,5.71 v39.12,5.71
EMAC_RX_DV  (via drill 0.35)
  Top 0.2: R30.2 74.93,38.31 74.04,37.43 74.04,36.32 v73.91,36.32 | v44.96,21.46 44.83,21.46 41.66,18.29 ESP32.12
  Bottom 0.2: v73.91,36.32 73.41,35.81 63.5,35.81 48.9,21.21 45.21,21.21 v44.96,21.46
EMAC_RXD0  (via drill 0.35)
  Top 0.2: ESP32.10 v41.4,20.83 | R18.1 77.76,38.31 76.67,37.22 76.67,35.9 v76.45,35.69
  Bottom 0.2: v76.45,35.69 76.07,35.31 63.75,35.31 49.02,20.57 41.66,20.57 v41.4,20.83
EMAC_RXD1  (via drill 0.35)
  Top 0.2: ESP32.11 v41.4,19.56 | R20.1 80.14,38.31 79.16,37.34 79.16,35.88 78.74,35.46 v78.74,35.43
  Bottom 0.2: v78.74,35.43 78.11,34.8 64.01,34.8 49.28,20.07 41.91,20.07 v41.4,19.56
EMAC_TX_CLK  (via drill 0.35)
  Top 0.2: R23.2 R24.1 68.41,30.48 68.41,28.74 67.99,28.32 v66.17,28.32 | ESP32.25 62.53,15.75 65.91,19.14 v65.91,25.78 64.52,24.38 R38.2 | v36.83,13.72 36.45,13.72 30.61,19.56 Q2.2 | v53.34,13.97 55.12,15.75 ESP32.25 | R11.2 58.66,15.75 ESP32.25
  Bottom 0.2: v66.17,28.32 65.91,28.07 v65.91,25.78 | v36.83,13.72 37.47,14.35 52.96,14.35 v53.34,13.97
EMAC_TX_EN
  Top 0.2: U1.16 74.51,30.11 73.81,30.11 73.29,29.59 72.27,29.59 69.9,27.23 60.8,27.23 59.48,25.91 ESP32.33
EMAC_TXD0
  Top 0.2: U1.17 73.93,29.6 73.41,29.08 72.51,29.08 70.23,26.8 60.97,26.8 59.82,25.65 59.82,24.77 58.42,23.37 ESP32.31
EMAC_TXD1  (via drill 0.35)
  Top 0.2: v73.47,28.26 74.32,29.1 U1.18 | ESP32.36 58.7,29.72 60.77,27.65 68.92,27.65 v69.22,27.94
  Bottom 0.2: v73.47,28.26 73.28,28.06 69.22,28.06 v69.22,27.94
EN  (via drill 0.35)
  Top 0.2: Q1.3 22.48,22.1 24,23.62 v26.42,23.62 | ESP32.3 38.36,29.72 C1.1 37.97,30.12 36.31,30.12 R13.2 v36.45,28.7
  Bottom 0.2: v26.42,23.62 v26.42,23.63 31.37,23.63 v36.45,28.7
ERROR_LED
  Top 0.2: JP5.2 59.98,8.6 R31.1
ETH_LED1
  Top 0.2: U1.3 78.4,30.11 83.03,30.11 87.16,25.98 87.16,6.56 88.52,5.21 R33.2
ETH_LED2
  Top 0.2: R32.2 86.74,4.91 86.74,25.65 82.79,29.6 U1.2
FTDI_DTR  (via drill 0.35)
  Top 0.2: R2.2 23.5,17.91 23.37,17.78 | 23.37,17.78 23.88,17.78 v24.38,17.27 | v24.51,22.35 25.78,22.35 Q2.3 | IC2.17 20.08,14.49 23.37,17.78
  Bottom 0.2: v24.38,17.27 24.38,22.23 v24.51,22.35
FTDI_RTS
  Top 0.2: IC2.15 20.03,13.49 23.08,16.54 25.16,16.54 25.69,17.07 R3.2 24.89,17.91 23.37,19.43 Q1.2
FTDI_RX  (via drill 0.35)
  Top 0.2: IC2.14 20.16,12.99 23.33,16.16 29.34,16.16 30.86,17.68 v30.86,17.78 | v54.74,28.45 ESP32.35
  Bottom 0.2: v30.86,17.78 37.98,24.9 50.04,24.9 53.59,28.45 v54.74,28.45
FTDI_TX  (via drill 0.35)
  Top 0.2: IC2.13 20.28,12.49 23.46,15.67 29.73,15.67 30.57,16.51 v30.61,16.51 | v53.72,27.18 v53.73,27.18 ESP32.34
  Bottom 0.2: v30.61,16.51 38.51,24.42 50.31,24.42 53.08,27.18 v53.72,27.18
GND  (via drill 0.35)
  Top 0.152: C16.2 C19.2 C17.2
  Top 0.2: R4.2 14.61,8.38 14.22,8.76 12.7,8.76 12.32,8.38 C4.2 10.29,8 | 13.97,11.36 IC2.4 13.99,13.59 | 13.99,13.59 13.99,13.99 IC2.THERMAL | IC2.10 16.99,12.7 | 16.99,12.7 16.99,13.49 IC2.THERMAL | 17.49,12.58 IC2.11 IC2.10 | IC2.9 16.51,11.36 | 16.51,11.36 16.51,12.7 16.99,12.7 | IC2.10 16.99,10.7 17.65,10.03 18.03,10.03 18.54,9.53 C5.2 19.94,9.27 C8.2 | X1.GND 16.54,6 16.64,6.1 17.66,6.1 18.48,5.28 X1.SPRT@2 | 10.29,8 C7.2 7.37,6.99 6.6,7.75 Q3.2 | v7.75,13.97 7.64,14.08 7.64,14.73 7.11,15.26 6.1,15.26 5.7,14.86 5.7,13.36 IC1.2 | C2.2 5.08,16.76 v4.45,16.13 | 13.45,15.99 IC2.41 IC2.42 13.21,15.49 v13.46,15.24 IC2.THERMAL | 12.62,12.49 IC2.48 IC2.47 13.39,12.99 13.54,13.13 | 13.54,13.13 13.99,13.59 | 12.45,17.91 12.49,17.95 IC2.36 12.49,19.64 12.06,20.07 12.06,21.59 11.56,22.1 C3.2 | 13.84,16.51 13.97,16.51 12.99,17.49 | IC2.35 12.99,17.49 | 12.99,17.49 12.99,17.36 | IC2.22 17.81,16.99 | 17.81,16.99 17.78,17.02 17.27,17.02 | 17.27,17.02 17.02,17.02 | IC2.23 17.43,17.49 17.4,17.53 17.27,17.4 17.27,17.02 | R21.2 82.55,27.81 v83.06,27.3 | C10.2 C12.2 81.93,32.77 82.69,33.53 v83.06,33.53 | C28.1 31.48,9.92 34.54,6.86 RTC.13 RTC.12 RTC.11 RTC.10 RTC.9 RTC.8 RTC.7 RTC.6 RTC.5 | ESP32.1 38.85,32.26 C1.2 | 59.44,11.81 ERROR.C | U1.25 v77.22,31.11 | U1.25 v75.69,29.59 | U1.25 v77.22,29.59 | U1.25 v75.69,31.11 | 10.29,8 v9.53,8.76 | R10.1 7.62,20.19 v7.62,20.45 | IC2.THERMAL 13.46,13.46 v13.46,13.21 | IC2.THERMAL 13.54,13.54 13.54,13.13 | 17.81,16.99 16.66,16.99 v16.51,17.14 | IC2.23 20.03,17.49 | 20.03,17.49 20.32,17.78 v20.32,19.05 | IC2.22 19.53,16.99 20.03,17.49 | IC2.10 16.53,11.34 16.51,11.36 | IC2.22 IC2.23
  Top 0.203: IC2.THERMAL 13.97,16.51
  Top 0.406: X1.SPRT@4 16.63,2.42 16.51,2.54 15.24,2.54 | 15.24,2.54 14.71,2.54 X1.BASE@1 | X1.SPRT@3 15.12,2.42 15.24,2.54
  Top 0.61: v66.8,24.38 66.8,22.31 R39.2 67.31,22.24 C11.2 | SG7050.2 89.85,38.1 v95.25,38.1 | RTC.8 25.53,1.4 v20.7,1.4 19.86,1.4 X1.SPRT@4 | X1.SPRT@4 18.84,4.92 18.48,5.28 | X1.SPRT@3 11.64,4.92 X1.SPRT@1 | X1.SPRT@3 X1.SPRT@4 | X1.SPRT@3 10.62,1.4 v9.27,1.4
  Bottom 0.2: v4.45,16.13 6.6,13.97 v7.75,13.97 | v9.53,8.76 11.94,6.35 X1.SPRT@1 | v7.62,20.45 6.1,20.45 v4.95,21.59 | v66.8,24.38 63.12,20.7 v62.99,20.7
  Bottom 0.406: v83.06,27.3 84.96,29.21 v85.09,29.21 | X1.SPRT@2 18.51,5.22 18.84,4.89 X1.SPRT@4 X1.SPRT@3 11.64,4.92 X1.SPRT@1
  Bottom 0.61: X1.SPRT@3 10.62,1.4 v9.27,1.4 | X1.SPRT@4 19.86,1.4 v20.7,1.4
  other vias: 16.51,15.24 83.19,37.72 91.19,22.23 93.73,29.84 95,31.11 95,28.57 96.27,29.84 95,29.84 59.44,37.47 60.71,36.2 60.71,29.21 61.98,37.47 59.44,34.92 29.46,28.45 25.53,13.08 30.86,14.99 4.95,24 59.44,4.45 60.71,5.71 60.71,3.17 61.98,4.45 60.71,4.45 60.45,18.92 62.87,32.38 61.34,14.22 63.88,14.22 63.88,12.95 63.88,2.79 30.86,2.79 2.29,2.29 2.29,9.91 2.29,17.53 2.29,23.88 2.29,31.5 2.29,37.85 9.91,37.85 17.53,37.85 23.88,37.85 27.69,37.85 42.93,27.69 45.47,17.53 45.47,11.18 42.93,11.18 48.01,11.18 44.2,12.45 46.74,12.45 49.28,12.45 44.2,9.91 46.74,9.91 49.28,9.91 54.36,11.18 54.36,9.91 54.36,12.45 54.36,18.8 54.36,20.07 54.36,21.34 54.36,22.61 55.63,22.61 55.63,21.34 55.63,20.07 55.63,18.8 53.09,20.07 53.09,21.34 48.01,17.53 46.74,18.8 46.74,16.26 44.2,16.26 44.2,18.8 42.93,17.53 49.28,16.26 49.28,18.8 50.55,17.53 41.66,16.26 42.93,22.61 42.93,28.96 44.2,28.96 45.47,28.96 45.47,27.69 48.01,27.69 48.01,28.96 44.2,26.42 42.93,26.42 41.66,26.42 41.66,27.69 41.66,28.96 44.2,27.69 46.74,28.96 46.74,27.69 54.36,30.61 33.4,2.79 28.32,2.79 30.99,4.7 93.73,14.61 95,15.88 95,13.34 96.27,14.61 95,14.61 93.73,22.23 95,23.5 95,20.95 96.27,22.23 95,22.23 13.46,17.14 16.51,13.21 83.82,30.48 87.12,28.96 36.2,37.85
  pour Top (isolate 0.3): 99.06,0 99.06,40.64 58.42,40.64 58.42,32.77 58.29,32.64 38.86,32.64 38.73,40.64 -0.76,40.64 -0.76,0 64.77,0 64.77,21.72 68.58,21.72 68.7,27.94 84.45,27.94 84.45,21.59 91.44,21.59 91.44,0
  pour Bottom (isolate 0.3): -0.89,0 -0.89,40.64 38.73,40.64 38.86,32.77 58.42,32.77 58.42,40.64 99.06,40.64 99.06,0 91.44,0 91.44,21.72 84.47,21.72 84.35,27.94 68.71,27.94 68.71,21.59 64.77,21.59 64.77,0
ISO_GND_ETH  (via drill 0.35)
  Top 0.152: v67.31,17.78 67.31,14.36 U$2.SHIELD1 | v67.31,1.52 67.44,1.4 v88.9,1.4
  Top 0.406: U$2.NC 80.96,17.45 U$2.GND 84.27,15.43 U$2.SHIELD2 | R19.1 v88.9,17.78 | R39.1 v67.31,17.78
  Top 0.61: v67.31,7.62 67.31,11.43 U$2.SHIELD1 | v85.09,17.78 85.09,13.71 U$2.SHIELD2 84.27,12.31 85.42,11.16 85.42,8.52 85.09,8.19 v85.09,7.62
  Bottom 0.61: v85.09,17.78 v88.9,17.78 | v67.31,1.52 v67.31,7.62 67.31,11.43 U$2.SHIELD1 67.31,14.36 v67.31,17.78 | v85.09,7.62 v88.9,7.62 | v88.9,1.4 v88.9,7.62 | v88.9,7.62 v88.9,12.7
  pour Top (isolate 0.3): 68.58,20.32 65.91,20.32 65.91,-0.25 90.17,-0.25 90.17,20.32 84.45,20.32 84.45,7.62 84.58,7.49 68.83,7.49 68.71,7.37 68.71,20.19
  pour Bottom (isolate 0.3): 84.58,20.32 90.17,20.32 90.17,-0.25 65.91,-0.25 65.91,20.32 68.71,20.32 68.71,7.62 68.58,7.49 84.33,7.49 84.45,7.37 84.45,20.19
N$1
  Top 0.2: R2.1 21.59,18.15 Q1.1
N$2
  Top 0.2: R3.1 26.54,18.76 26.54,19.05 26.04,19.56 Q2.1
N$3
  Top 0.2: IC2.1 12.49,10.97 12.32,10.79 9.4,10.79 8.51,9.91 6.1,9.91 5.4,9.21 Q3.1
N$4
  Top 0.2: IC2.2 12.99,10.7 12.57,10.29 9.58,10.29 Q3.3
N$5
  Top 0.2: IC2.5 14.49,9.64 R4.1
N$6
  Top 0.2: LED2.A 21.46,2.81 R6.2
N$7
  Top 0.2: IC2.34 13.49,20.04 R1.1
N$8
  Top 0.2: R5.2 9.02,2.81 LED1.A
N$9
  Top 0.2: IC1.3 4.76,14.29 R7.1 4.95,15.24 5.48,15.77 7.49,15.77 8.27,14.99 IC2.43
N$10
  Top 0.2: IC1.5 5.71,11.56 5.97,11.81 8.64,11.81 9.53,12.7 9.53,13.46 10.05,13.99 IC2.45
N$11
  Top 0.2: IC1.4 4.76,11.75 5.33,12.32 8.26,12.32 8.89,12.95 8.89,13.58 9.8,14.49 IC2.44
N$12
  Top 0.2: IC1.1 6.67,14.29 R7.2
N$14
  Top 0.2: U1.7 79.23,33.81 79.23,34.69 80.26,35.73 R20.2
N$15
  Top 0.2: R18.2 77.98,33.68 77.19,32.9 U1.8
N$16
  Top 0.2: R31.2 61.88,10.11 ERROR.A
N$17
  Top 0.2: U1.24 79.44,28.42 R21.1
N$18
  Top 0.2: U$2.Y- 81.97,2.96 R32.1
N$19
  Top 0.2: U1.5 80.16,31.1 R16.2
N$20  (via drill 0.35)
  Top 0.2: U1.10 76.2,33.66 v75.95,33.91 | v73.91,34.16 73.15,34.92 73.15,36.79 72.22,37.72 R27.1
  Bottom 0.2: v75.95,33.91 75.7,34.16 v73.91,34.16
N$21
  Top 0.2: R23.1 73.24,31.37 73.5,31.1 U1.14
N$22
  Top 0.2: R30.1 75.18,33.57 75.7,33.05 U1.11
N$23
  Top 0.2: U$2.G- 74.72,2.03 87.97,2.03 88.52,2.58 R33.1
N$29
  Top 0.2: JP8.1 JP7.1 JP6.2 26.52,36.35 38.23,24.64 ESP32.7
PHY_POWER  (via drill 0.35)
  Top 0.152: SG7050.1 89.41,32.77 v87.63,30.99
  Top 0.2: ESP32.29 R12.1 64.14,25.36 v64.14,25.4
  Bottom 0.2: v87.63,30.99 86.79,31.83 68.2,31.83 65.41,29.04 65.41,26.67 v64.14,25.4
PM1
  Top 0.2: SV1.4 JP4.1 13.19,35.56 R17.1
RD_N
  Top 0.152: R34.1 79.03,24.09 79.5,23.62
  Top 0.2: U1.22 76.7,27.45 79.5,24.65 79.5,23.62 79.5,18.16 78.93,17.59 77.79,17.59 77.09,18.29 77.09,19.18 77.6,19.68 77.98,19.68 78.42,19.24 U$2.RD-
RD_P
  Top 0.152: R35.1 80.21,25.15 79.85,24.79
  Top 0.2: U1.23 77.2,27.44 79.85,24.79 79.85,18.02 79.01,17.17 75.6,17.17 U$2.RD+
RTC_32K  (via drill 0.35)
  Top 0.2: JP3.1 22.73,12.45 25.02,14.73 v26.04,14.73 | v38.1,27.18 ESP32.5
  Bottom 0.2: v26.04,14.73 38.1,26.8 v38.1,27.18
RTC_INT  (via drill 0.35)
  Top 0.2: JP2.1 21.97,9.91 v21.97,13.08 | v38.1,28.45 ESP32.4
  Bottom 0.2: v21.97,13.08 37.34,28.45 v38.1,28.45
RTC_RST  (via drill 0.35)
  Top 0.2: v34.8,30.61 33.4,32 31.62,32 26.67,36.96 15.37,36.96 JP4.2 | v50.67,27.56 v50.67,19.68 | v21.21,11.94 21.43,11.71 21.43,7.75 22.33,6.86 JP9.1 | JP5.1 v62.61,8.13 | ESP32.26 v55.75,17.02
  Bottom 0.2: v50.67,27.56 47.62,30.61 v34.8,30.61 28.68,24.49 22.96,24.49 21.21,22.74 v21.21,11.94 | v50.67,19.68 51.31,19.68 53.98,17.02 v55.75,17.02 62.61,10.16 v62.61,8.13
SCL  (via drill 0.35)
  Top 0.2: ESP32.9 37.94,22.1 R15.1 37.72,21.72 37.85,21.59 v37.85,20.07 | v35.81,12.06 35.81,10.92 RTC.16
  Bottom 0.2: v37.85,20.07 37.21,19.43 36.57,19.43 34.42,17.28 34.42,13.46 v35.81,12.06
SDA  (via drill 0.35)
  Top 0.2: ESP32.8 37.67,23.37 R25.1 36.73,22.67 36.73,20.35 v36.7,20.32 | v33.91,10.29 33.91,10.16 34.67,9.4 RTC.15
  Bottom 0.2: v36.7,20.32 33.91,17.53 v33.91,10.29
SMI_MDC
  Top 0.2: ESP32.37 57.71,30.73 63.63,30.73 65.57,32.68 73.08,32.68 74.16,31.6 U1.13
SMI_MDIO  (via drill 0.35)
  Top 0.2: U1.12 75.2,32.75 74.55,33.4 69.94,33.4 | R26.1 71.59,35.05 69.94,33.4 | 69.94,33.4 v65.04,33.4 | ESP32.30 59.82,22.1 v60.2,22.48
  Bottom 0.2: v60.2,22.48 62.36,24.64 62.36,30.72 v65.04,33.4
TD_N
  Top 0.152: R36.1 73.97,26.42 74.32,26.06
  Top 0.2: U1.20 75.7,27.44 74.32,26.06 74.32,18.06 73.79,17.53 72.9,17.53 72.52,17.91 72.52,18.29 72.96,18.73 U$2.TD-
TD_P
  Top 0.152: R37.1 75.14,24.09 74.68,23.62 74.68,23.5
  Top 0.2: U1.21 76.2,27.45 74.68,25.92 74.68,23.5 74.68,17.92 73.77,17.01 72.9,17.01 U$2.TD+
VCCA
  Top 0.2: IC2.37 11.34,20.54 C3.1
VDDCR
  Top 0.2: U1.6 79.55,32.77 C12.1 C10.1
VPHY
  Top 0.2: C4.1 FB1.1 13.49,9.55 IC2.3
VPLL
  Top 0.2: FB2.2 C5.1 17.02,9.78 15.99,10.81 IC2.8

### Text on the board
tNames: Benjamin Voelker, University of Freiburg